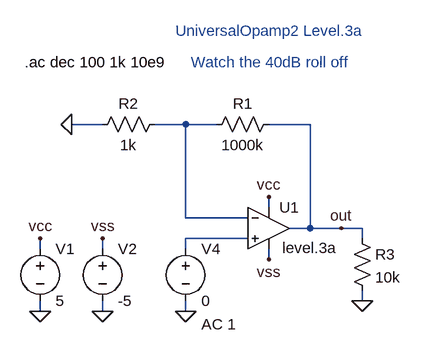
[diagram p0: schematic UniversalOpamp2_level_3a.asc]
UniversalOpamp2_level_3a.asc, the LTspice schematic file:
Version 4
SHEET 1 880 680
WIRE -32 0 -80 0
WIRE 96 0 48 0
WIRE 144 0 96 0
WIRE 288 0 224 0
WIRE 224 128 224 112
WIRE 96 144 96 0
WIRE 192 144 96 144
WIRE 288 160 288 0
WIRE 288 160 256 160
WIRE 336 160 288 160
WIRE 368 160 336 160
WIRE 192 176 96 176
WIRE 368 176 368 160
WIRE -128 192 -128 176
WIRE -32 192 -32 176
WIRE 96 192 96 176
WIRE 224 208 224 192
WIRE 368 272 368 256
WIRE -128 288 -128 272
WIRE -32 288 -32 272
WIRE 96 288 96 272
FLAG -80 0 0
FLAG 224 112 vcc
FLAG 224 208 vss
FLAG -128 288 0
FLAG -32 288 0
FLAG -128 176 vcc
FLAG -32 176 vss
FLAG 368 272 0
FLAG 96 288 0
FLAG 336 160 out
SYMBOL Opamps\\UniversalOpamp2 224 160 R0
WINDOW 38 21 30 Left 0
SYMATTR InstName U1
SYMATTR SpiceModel level.3a
SYMATTR Value2 Avol=100k GBW=10Meg Slew=10Meg
SYMBOL res 128 16 R270
WINDOW 0 32 56 VTop 0
WINDOW 3 0 56 VBottom 0
SYMATTR InstName R1
SYMATTR Value 1000k
SYMBOL res -48 16 R270
WINDOW 0 32 56 VTop 0
WINDOW 3 0 56 VBottom 0
SYMATTR InstName R2
SYMATTR Value 1k
SYMBOL voltage -128 176 R0
SYMATTR InstName V1
SYMATTR Value 5
SYMBOL voltage -32 176 R0
SYMATTR InstName V2
SYMATTR Value -5
SYMBOL res 352 160 R0
SYMATTR InstName R3
SYMATTR Value 10k
SYMBOL voltage 96 176 R0
WINDOW 123 24 132 Left 0
WINDOW 39 0 0 Left 0
SYMATTR InstName V4
SYMATTR Value 0
SYMATTR Value2 AC 1
TEXT -152 -96 Left 0 !.ac dec 100 1k 10e9
TEXT 104 -96 Left 0 ;Watch the 40dB roll off
TEXT 80 -144 Left 0 ;UniversalOpamp2 Level.3a

The netlist it stands for:
* UniversalOpamp2_level_3a.asc
XU1 N002 N001 vcc vss out level.3a Avol=100k GBW=10Meg Slew=10Meg ilimit=25m rail=0 Vos=0 phimargin=45 en=0 enk=0 in=0 ink=0 Rin=500Meg  ; pins IN+ IN- V+ V- OUT
R1 N001 out 1000k
R2 0 N001 1k
V1 vcc 0 5
V2 vss 0 -5
R3 out 0 10k
V4 N002 0 0 AC 1
.ac dec 100 1k 10e9
* Watch the 40dB roll off
* UniversalOpamp2 Level.3a
.lib UniversalOpamps2.sub
.backanno
.end